# Altium schematic sheet Elkapod_power_supply_conveter_module.SchDoc: Elkapod Power Supply Block Diagram
size A3; SheetNumber: 1; SheetTotal: 6
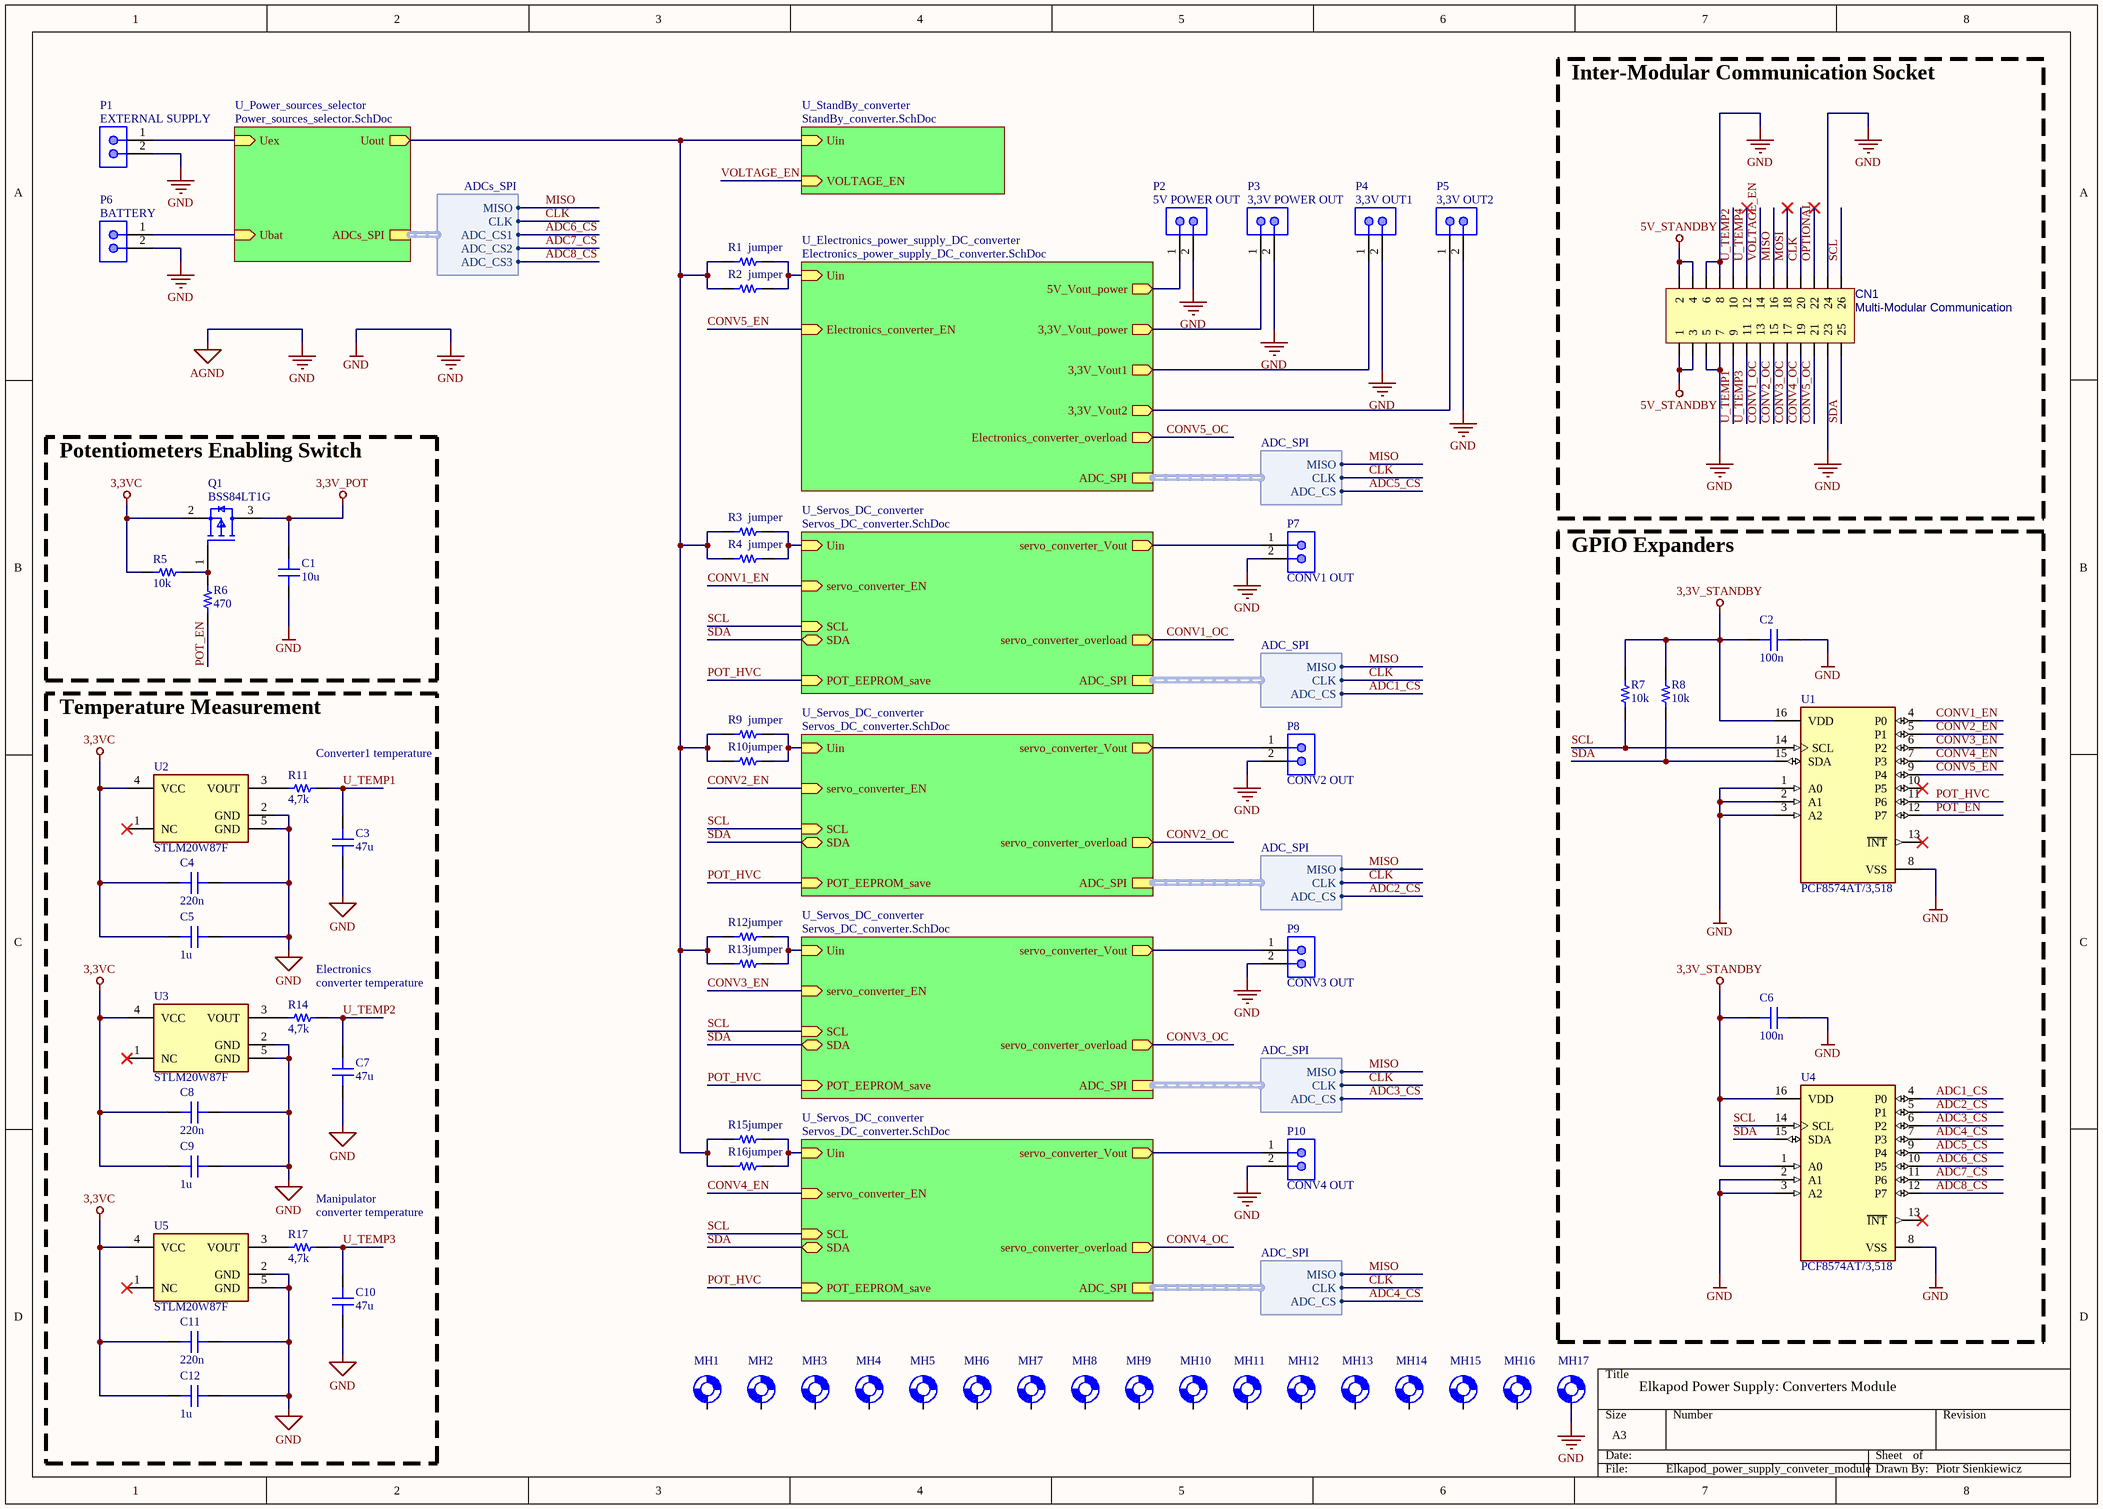
[diagram p0: Elkapod_power_supply_conveter_module.SchDoc]

## Parts
C1  10u  [CAP 0603_1608]
C2  100n  [CAP 0603_1608]
C3  47u  [CAP 0603_1608]
C4  220n  [CAP 0603_1608]
C5  1u  [CAP 0603_1608]
C6  100n  [CAP 0603_1608]
C7  47u  [CAP 0603_1608]
C8  220n  [CAP 0603_1608]
C9  1u  [CAP 0603_1608]
C10  47u  [CAP 0603_1608]
C11  220n  [CAP 0603_1608]
C12  1u  [CAP 0603_1608]
CN1  Multi-Modular Communication  [GP_13x2_F]
MH1  M3 Mounting Hole  [M3_MOUNTING_HOLE]  (value not drawn)
MH2  M3 Mounting Hole  [M3_MOUNTING_HOLE]  (value not drawn)
MH3  M3 Mounting Hole  [M3_MOUNTING_HOLE]  (value not drawn)
MH4  M3 Mounting Hole  [M3_MOUNTING_HOLE]  (value not drawn)
MH5  M3 Mounting Hole  [M3_MOUNTING_HOLE]  (value not drawn)
MH6  M3 Mounting Hole  [M3_MOUNTING_HOLE]  (value not drawn)
MH7  M3 Mounting Hole  [M3_MOUNTING_HOLE]  (value not drawn)
MH8  M3 Mounting Hole  [M3_MOUNTING_HOLE]  (value not drawn)
MH9  M3 Mounting Hole  [M3_MOUNTING_HOLE]  (value not drawn)
MH10  M3 Mounting Hole  [M3_MOUNTING_HOLE]  (value not drawn)
MH11  M3 Mounting Hole  [M3_MOUNTING_HOLE]  (value not drawn)
MH12  M3 Mounting Hole  [M3_MOUNTING_HOLE]  (value not drawn)
MH13  M3 Mounting Hole  [M3_MOUNTING_HOLE]  (value not drawn)
MH14  M3 Mounting Hole  [M3_MOUNTING_HOLE]  (value not drawn)
MH15  M3 Mounting Hole  [M3_MOUNTING_HOLE]  (value not drawn)
MH16  M3 Mounting Hole  [M3_MOUNTING_HOLE]  (value not drawn)
MH17  M3 Mounting Hole  [M3_MOUNTING_HOLE]  (value not drawn)
P1  EXTERNAL SUPPLY  [XT60PB-M]
P2  5V POWER OUT  [2x2,5mm2_WIRE]
P3  3,3V POWER OUT  [2x2,5mm2_WIRE]
P4  3,3V OUT1  [2x2,5mm2_WIRE]
P5  3,3V OUT2  [2x2,5mm2_WIRE]
P6  BATTERY  [XT60PB-M]
P7  CONV1 OUT  [2x2,5mm2_WIRE]
P8  CONV2 OUT  [2x2,5mm2_WIRE]
P9  CONV3 OUT  [2x2,5mm2_WIRE]
P10  CONV4 OUT  [2x2,5mm2_WIRE]
Q1  BSS84LT1G  [FP-318-08-IPC_A]
R1  jumper  [STACKPOLE CSM2512]
R2  jumper  [STACKPOLE CSM2512]
R3  jumper  [STACKPOLE CSM2512]
R4  jumper  [STACKPOLE CSM2512]
R5  10k  [RES 0603_1608]
R6  470  [RES 0603_1608]
R7  10k  [RES 0603_1608]
R8  10k  [RES 0603_1608]
R9  jumper  [STACKPOLE CSM2512]
R10  jumper  [STACKPOLE CSM2512]
R11  4,7k  [RES 0603_1608]
R12  jumper  [STACKPOLE CSM2512]
R13  jumper  [STACKPOLE CSM2512]
R14  4,7k  [RES 0603_1608]
R15  jumper  [STACKPOLE CSM2512]
R16  jumper  [STACKPOLE CSM2512]
R17  4,7k  [RES 0603_1608]
U1  PCF8574AT/3,518  [FP-SOT162-1-MFG]
U2  STLM20W87F  [FP-SOT323-5L-7091413-MFG]
U3  STLM20W87F  [FP-SOT323-5L-7091413-MFG]
U4  PCF8574AT/3,518  [FP-SOT162-1-MFG]
U5  STLM20W87F  [FP-SOT323-5L-7091413-MFG]

## Blocks framed on the sheet
Inter-Modular Communication Socket: CN1
Potentiometers Enabling Switch: C1 Q1 R5 R6
GPIO Expanders: C2 C6 R7 R8 U1 U4
Temperature Measurement: C3-C5 C7-C12 R11 R14 R17 U2 U3 U5

## Sub-sheets
U_Electronics_power_supply_DC_converter = Electronics_power_supply_DC_converter.SchDoc: Uin (in), Electronics_converter_EN (in), Electronics_converter_overload (out), 3,3V_Vout2 (out), 3,3V_Vout1 (out), 3,3V_Vout_power (out), 5V_Vout_power (out), ADC_SPI (harness ADC_SPI)
U_Power_sources_selector = Power_sources_selector.SchDoc: Ubat (in), Uout (out), Uex (in), ADCs_SPI (harness ADCs_SPI)
U_Servos_DC_converter = Servos_DC_converter.SchDoc: Uin (in), servo_converter_EN (in), servo_converter_overload (out), servo_converter_Vout (out), POT_EEPROM_save (in), SDA (bidir), SCL (in), ADC_SPI (harness ADC_SPI)  | RF2_value: 2,7k; RF1_value: 1k; RF3_value: 910
U_Servos_DC_converter = Servos_DC_converter.SchDoc: Uin (in), servo_converter_EN (in), servo_converter_overload (out), servo_converter_Vout (out), POT_EEPROM_save (in), SDA (bidir), SCL (in), ADC_SPI (harness ADC_SPI)  | RF2_value: 2,7k; RF1_value: 1k; RF3_value: 910
U_Servos_DC_converter = Servos_DC_converter.SchDoc: Uin (in), servo_converter_EN (in), servo_converter_overload (out), servo_converter_Vout (out), POT_EEPROM_save (in), SDA (bidir), SCL (in), ADC_SPI (harness ADC_SPI)  | RF2_value: 2,7k; RF1_value: 1k; RF3_value: 910
U_Servos_DC_converter = Servos_DC_converter.SchDoc: Uin (in), servo_converter_EN (in), servo_converter_overload (out), servo_converter_Vout (out), POT_EEPROM_save (in), SDA (bidir), SCL (in), ADC_SPI (harness ADC_SPI)  | RF2_value: 6,8k; RF1_value: 3,3k; RF3_value: 1,3k
U_StandBy_converter = StandBy_converter.SchDoc: Uin (in), VOLTAGE_EN (in)

## Harnesses
ADC_SPI: MISO, CLK, ADC_CS
ADCs_SPI: MISO, CLK, ADC_CS1, ADC_CS2, ADC_CS3

## Nets
3,3V_POT: C1.2 Q1.3(D)
3,3V_STANDBY: C2.2 C6.2 R7.2 R8.2 U1.16(VDD) U4.1(A0) U4.16(VDD)
3,3VC: C4.2 C5.2 C8.2 C9.2 C11.2 C12.2 Q1.2(S) R5.1 U2.4(VCC) U3.4(VCC) U5.4(VCC)
5V_STANDBY: CN1.1 CN1.2 CN1.3 CN1.4
AGND: C1.1 C2.1 C3.1 C4.1 C5.1 C6.1 C7.1 C8.1 C9.1 C10.1 C11.1 C12.1 CN1.5 CN1.6 CN1.7 CN1.8 CN1.23 CN1.24 MH17.1 P1.2(-) P2.2(-) P3.2(-) P4.2(-) P5.2(-) P6.2(-) P7.2(-) P8.2(-) P9.2(-) P10.2(-) U1.1(A0) U1.2(A1) U1.3(A2) U1.8(VSS) U2.2(GND) U2.5(GND) U3.2(GND) U3.5(GND) U4.2(A1) U4.3(A2) U4.8(VSS) U5.2(GND) U5.5(GND)  [also labelled GND]
ADC1_CS: U4.4(P0) ; sheet U_Servos_DC_converter/ADC_SPI.ADC_CS
ADC2_CS: U4.5(P1) ; sheet U_Servos_DC_converter/ADC_SPI.ADC_CS
ADC3_CS: U4.6(P2) ; sheet U_Servos_DC_converter/ADC_SPI.ADC_CS
ADC4_CS: U4.7(P3) ; sheet U_Servos_DC_converter/ADC_SPI.ADC_CS
ADC5_CS: U4.9(P4) ; sheet U_Electronics_power_supply_DC_converter/ADC_SPI.ADC_CS
ADC6_CS: U4.10(P5) ; sheet U_Power_sources_selector/ADCs_SPI.ADC_CS1
ADC7_CS: U4.11(P6) ; sheet U_Power_sources_selector/ADCs_SPI.ADC_CS2
ADC8_CS: U4.12(P7) ; sheet U_Power_sources_selector/ADCs_SPI.ADC_CS3
CLK: CN1.20 ; sheet U_Electronics_power_supply_DC_converter/ADC_SPI.CLK, sheet U_Servos_DC_converter/ADC_SPI.CLK, sheet U_Power_sources_selector/ADCs_SPI.CLK
CONV1_EN: U1.4(P0) ; sheet U_Servos_DC_converter/servo_converter_EN
CONV1_OC: CN1.13 ; sheet U_Servos_DC_converter/servo_converter_overload
CONV2_EN: U1.5(P1) ; sheet U_Servos_DC_converter/servo_converter_EN
CONV2_OC: CN1.15 ; sheet U_Servos_DC_converter/servo_converter_overload
CONV3_EN: U1.6(P2) ; sheet U_Servos_DC_converter/servo_converter_EN
CONV3_OC: CN1.17 ; sheet U_Servos_DC_converter/servo_converter_overload
CONV4_EN: U1.7(P3) ; sheet U_Servos_DC_converter/servo_converter_EN
CONV4_OC: CN1.19 ; sheet U_Servos_DC_converter/servo_converter_overload
CONV5_EN: U1.9(P4) ; sheet U_Electronics_power_supply_DC_converter/Electronics_converter_EN
CONV5_OC: CN1.21 ; sheet U_Electronics_power_supply_DC_converter/Electronics_converter_overload
MISO: CN1.16 ; sheet U_Electronics_power_supply_DC_converter/ADC_SPI.MISO, sheet U_Servos_DC_converter/ADC_SPI.MISO, sheet U_Power_sources_selector/ADCs_SPI.MISO
MOSI: CN1.18
OPTIONAL: CN1.22
POT_EN: R6.2 U1.12(P7)
POT_HVC: U1.11(P6) ; sheet U_Servos_DC_converter/POT_EEPROM_save, sheet U_Servos_DC_converter/POT_EEPROM_save, sheet U_Servos_DC_converter/POT_EEPROM_save, sheet U_Servos_DC_converter/POT_EEPROM_save
SCL: CN1.26 R7.1 U1.14(SCL) U4.14(SCL) ; sheet U_Servos_DC_converter/SCL, sheet U_Servos_DC_converter/SCL, sheet U_Servos_DC_converter/SCL, sheet U_Servos_DC_converter/SCL
SDA: CN1.25 R8.1 U1.15(SDA) U4.15(SDA) ; sheet U_Servos_DC_converter/SDA, sheet U_Servos_DC_converter/SDA, sheet U_Servos_DC_converter/SDA, sheet U_Servos_DC_converter/SDA
U_TEMP1: C3.2 CN1.9 R11.2
U_TEMP2: C7.2 CN1.10 R14.2
U_TEMP3: C10.2 CN1.11 R17.2
U_TEMP4: CN1.12
VOLTAGE_EN: CN1.14 ; sheet U_StandBy_converter/VOLTAGE_EN
NetP1_1: P1.1(+) ; sheet U_Power_sources_selector/Uex
NetP2_1: P2.1(+) ; sheet U_Electronics_power_supply_DC_converter/5V_Vout_power
NetP3_1: P3.1(+) ; sheet U_Electronics_power_supply_DC_converter/3,3V_Vout_power
NetP4_1: P4.1(+) ; sheet U_Electronics_power_supply_DC_converter/3,3V_Vout1
NetP5_1: P5.1(+) ; sheet U_Electronics_power_supply_DC_converter/3,3V_Vout2
NetP6_1: P6.1(+) ; sheet U_Power_sources_selector/Ubat
NetP7_1: P7.1(+) ; sheet U_Servos_DC_converter/servo_converter_Vout
NetP8_1: P8.1(+) ; sheet U_Servos_DC_converter/servo_converter_Vout
NetP9_1: P9.1(+) ; sheet U_Servos_DC_converter/servo_converter_Vout
NetP10_1: P10.1(+) ; sheet U_Servos_DC_converter/servo_converter_Vout
NetQ1_1: Q1.1(G) R5.2 R6.1
NetR1_1: R1.1 R2.1 ; sheet U_Electronics_power_supply_DC_converter/Uin
NetR1_2: R1.2 R2.2 R3.2 R4.2 R9.2 R10.2 R12.2 R13.2 R15.2 R16.2 ; sheet U_Power_sources_selector/Uout, sheet U_StandBy_converter/Uin
NetR3_1: R3.1 R4.1 ; sheet U_Servos_DC_converter/Uin
NetR9_1: R9.1 R10.1 ; sheet U_Servos_DC_converter/Uin
NetR11_1: R11.1 U2.3(VOUT)
NetR12_1: R12.1 R13.1 ; sheet U_Servos_DC_converter/Uin
NetR14_1: R14.1 U3.3(VOUT)
NetR15_1: R15.1 R16.1 ; sheet U_Servos_DC_converter/Uin
NetR17_1: R17.1 U5.3(VOUT)

Not connected (* = marked no-connect by the designer): MH1 1; MH2 1; MH3 1; MH4 1; MH5 1; MH6 1; MH7 1; MH8 1; MH9 1; MH10 1; MH11 1; MH12 1; MH13 1; MH14 1; MH15 1; MH16 1; U1 10(P5)* 13(~{INT})*; U2 1(NC)*; U3 1(NC)*; U4 13(~{INT})*; U5 1(NC)*

## Notes on the sheet
- (near R11) Converter1 temperature
- (near R14) converter temperature
- (near R14) Electronics
- (near R17) converter temperature
- (near R17) Manipulator
- Elkapod Power Supply: Converters Module
- Piotr Sienkiewicz

## Library data of the parts
C1 = C0603C272F3GAC7867: CAP CER 10uF 35V X5R 0603; manufacturer: KEMET; Temperature Coefficient: C0G, NP0; Tolerance: ±1%; Voltage - Rated: 25V; Part Number: C0603C272F3GAC7867; Value: 10u; Applications: General Purpose; Capacitance: 10u; componentlink1description: Datasheet; componentlink1url: https://api.kemet.com/component-edge/download/datasheet/C0603C272F3GACTU.pdf; componentlink2description: DigiKey Link; componentlink2url: https://www.digikey.com/en/products/detail/kemet/C0603C272F3GAC7867/2200413; Device Package: 0603 (1608 Metric); Features: Low ESL; lastupdated: 09.02.2024 20:10:30; Lifecycle Status: Active; Minimum Order: 1; Mounting Type: Surface Mount, MLCC; Operating Temperature: -55°C ~ 125°C; Package / Case: 0603 (1608 Metric); packaging: TapeAndReel; partid: 2138; Part Status: Active; price: 0.40; series: SMD Comm C0G; Size / Dimension: 0.063" L x 0.031" W (1.60mm x 0.80mm); Thickness (Max): 0.034" (0.87mm)
C2 C6 = C0603C272F3GAC7867: CAP CER 100nF 25V X5R 0603; manufacturer: KEMET; Temperature Coefficient: C0G, NP0; Tolerance: ±1%; Part Number: C0603C272F3GAC7867; Value: 100n; Applications: General Purpose; Capacitance: 100n; componentlink1description: Datasheet; componentlink1url: https://api.kemet.com/component-edge/download/datasheet/C0603C272F3GACTU.pdf; componentlink2description: DigiKey Link; componentlink2url: https://www.digikey.com/en/products/detail/kemet/C0603C272F3GAC7867/2200413; Device Package: 0603 (1608 Metric); Features: Low ESL; lastupdated: 09.02.2024 20:10:30; Lifecycle Status: Active; Minimum Order: 1; Mounting Type: Surface Mount, MLCC; Operating Temperature: -55°C ~ 125°C; Package / Case: 0603 (1608 Metric); packaging: TapeAndReel; partid: 2138; Part Status: Active; price: 0.40; series: SMD Comm C0G; Size / Dimension: 0.063" L x 0.031" W (1.60mm x 0.80mm); Thickness (Max): 0.034" (0.87mm); Voltage - Rated: 25V
C3 C7 C10 = C0603C272F3GAC7867: CAP CER 47uF 6,3V X5R 0603; manufacturer: KEMET; Temperature Coefficient: C0G, NP0; Tolerance: ±1%; Voltage - Rated: 25V; Part Number: C0603C272F3GAC7867; Value: 47u; Applications: General Purpose; Capacitance: 47u; componentlink1description: Datasheet; componentlink1url: https://api.kemet.com/component-edge/download/datasheet/C0603C272F3GACTU.pdf; componentlink2description: DigiKey Link; componentlink2url: https://www.digikey.com/en/products/detail/kemet/C0603C272F3GAC7867/2200413; Device Package: 0603 (1608 Metric); Features: Low ESL; lastupdated: 09.02.2024 20:10:30; Lifecycle Status: Active; Minimum Order: 1; Mounting Type: Surface Mount, MLCC; Operating Temperature: -55°C ~ 125°C; Package / Case: 0603 (1608 Metric); packaging: TapeAndReel; partid: 2138; Part Status: Active; price: 0.40; series: SMD Comm C0G; Size / Dimension: 0.063" L x 0.031" W (1.60mm x 0.80mm); Thickness (Max): 0.034" (0.87mm)
C4 C8 C11 = C0603C272F3GAC7867: CAP CER 220nF 25V X5R 0603; manufacturer: KEMET; Temperature Coefficient: C0G, NP0; Tolerance: ±1%; Part Number: C0603C272F3GAC7867; Value: 220n; Applications: General Purpose; Capacitance: 220n; componentlink1description: Datasheet; componentlink1url: https://api.kemet.com/component-edge/download/datasheet/C0603C272F3GACTU.pdf; componentlink2description: DigiKey Link; componentlink2url: https://www.digikey.com/en/products/detail/kemet/C0603C272F3GAC7867/2200413; Device Package: 0603 (1608 Metric); Features: Low ESL; lastupdated: 09.02.2024 20:10:30; Lifecycle Status: Active; Minimum Order: 1; Mounting Type: Surface Mount, MLCC; Operating Temperature: -55°C ~ 125°C; Package / Case: 0603 (1608 Metric); packaging: TapeAndReel; partid: 2138; Part Status: Active; price: 0.40; series: SMD Comm C0G; Size / Dimension: 0.063" L x 0.031" W (1.60mm x 0.80mm); Thickness (Max): 0.034" (0.87mm); Voltage - Rated: 25V
C5 C9 C12 = C0603C272F3GAC7867: CAP CER 1uF 25V X5R 0603; manufacturer: KEMET; Temperature Coefficient: C0G, NP0; Tolerance: ±1%; Part Number: C0603C272F3GAC7867; Value: 1u; Applications: General Purpose; Capacitance: 1u; componentlink1description: Datasheet; componentlink1url: https://api.kemet.com/component-edge/download/datasheet/C0603C272F3GACTU.pdf; componentlink2description: DigiKey Link; componentlink2url: https://www.digikey.com/en/products/detail/kemet/C0603C272F3GAC7867/2200413; Device Package: 0603 (1608 Metric); Features: Low ESL; lastupdated: 09.02.2024 20:10:30; Lifecycle Status: Active; Minimum Order: 1; Mounting Type: Surface Mount, MLCC; Operating Temperature: -55°C ~ 125°C; Package / Case: 0603 (1608 Metric); packaging: TapeAndReel; partid: 2138; Part Status: Active; price: 0.40; series: SMD Comm C0G; Size / Dimension: 0.063" L x 0.031" W (1.60mm x 0.80mm); Thickness (Max): 0.034" (0.87mm); Voltage - Rated: 25V
CN1 = CN_13x2
P1 P6 = XT60PB-M: XT60UPB-M; 30A/500V straight female DC PCB socket (pin1 -> +, pin2 -> -)
P2-P5 P7-P10 = 2X2,5mm2_WIRE: 2x2,5mm2 wire pads
Q1 = CMP-1058-00762-2: MOSFET P-CH 50V 130MA SOT-23; Max Power Dissipation: 225mW; On-State Resistance: 10R; Nominal Vgs: 2V; Gate to Source Voltage (Vgs): 20V; Rise Time: 1ns; Turn-Off Delay Time: 16ns; Voltage Rating (DC): -50V; Turn-On Delay Time: 3.6ns; Number of Elements: 1; Current Rating: -130mA; Input Capacitance: 30pF; Threshold Voltage: -2V; Element Configuration: Single; Drain to Source Breakdown Voltage: 50V; Continuous Drain Current (ID): 130mA; Length: 0.119inch; Drain to Source Voltage (Vdss): 50V; Min Operating Temperature: -55°C; Contact Plating: Tin; Lead Free: Lead Free; Width: 0.055inch; Case/Package: SOT-23-3; Max Operating Temperature: 150°C; Halogen Free: Halogen Free; Radiation Hardening: No; Drain to Source Resistance: 10R; REACH SVHC: No SVHC; Power Dissipation: 225mW; Number of Pins: 3; Package Quantity: 1; Packaging: Tape and Reel; Fall Time: 1ns; Rds On Max: 10R; Height: 0.04inch
R1-R4 R9 R10 R12 R13 R15 R16 = CSM2512FT20L0: RES 0 OHM 1W 2512; manufacturer: Stackpole Electronics Inc; Power (Watts): 3W; Temperature Coefficient: ±50ppm/°C; Tolerance: ±1%; value: 20 mOhms; Part Number: CSM2512FT20L0; componentlink1description: Datasheet; componentlink1url: https://www.seielect.com/Catalog/SEI-CSM.PDF; componentlink2description: DigiKey Link; componentlink2url: https://www.digikey.com/en/products/detail/stackpole-electronics-inc/CSM2512FT20L0/6270239; Composition: Metal Element; Device Package: 2512 (6332 Metric); Features: Current Sense; Height - Seated (Max): 0.035" (0.90mm); lastupdated: 03.06.2024 20:27:03; Lifecycle Status: Active; Minimum Order: 4000; Number of Terminations: 2; Operating Temperature: -55°C ~ 170°C; Package / Case: 2512 (6332 Metric); packaging: TapeAndReel; Part Status: Active; price: 0.19; Resistance: jumper; series: CSM; Size / Dimension: 0.252" L x 0.126" W (6.40mm x 3.20mm); Supplier Device Package: 2512
R5 R7 R8 = RNCS0603BKE10K0: RES 10K OHM 1% 0,1W 0603; Manufacturer: Stackpole Electronics Inc; Power (Watts): 0.063W, 1/16W; Temperature Coefficient: ±25ppm/°C; Tolerance: ±0.1%; Part Number: RNCS0603BKE10K0; Value: 10k; Composition: Thin Film; Device Package: 0603 (1608 Metric); Features: Anti-Corrosive, Automotive AEC-Q200, Moisture Resistant; Height - Seated (Max): 0.022" (0.55mm); LastUpdated: 09.02.2024 20:43:37; Lifecycle Status: Active; Minimum Order: 1; Number of Terminations: 2; Operating Temperature: -55°C ~ 155°C; Package / Case: 0603 (1608 Metric); Packaging: TapeAndReel; PartId: 4838; Part Status: Active; Price: 0.06; Ratings: AEC-Q200; Resistance: 10k; Series: RNCS; Size / Dimension: 0.061" L x 0.031" W (1.55mm x 0.80mm); Supplier Device Package: 0603
R6 = RNCS0603BKE10K0: RES 470 OHM 1% 0,1W 0603; Manufacturer: Stackpole Electronics Inc; Power (Watts): 0.063W, 1/16W; Temperature Coefficient: ±25ppm/°C; Tolerance: ±0.1%; Part Number: RNCS0603BKE10K0; Value: 470; Composition: Thin Film; Device Package: 0603 (1608 Metric); Features: Anti-Corrosive, Automotive AEC-Q200, Moisture Resistant; Height - Seated (Max): 0.022" (0.55mm); LastUpdated: 09.02.2024 20:43:37; Lifecycle Status: Active; Minimum Order: 1; Number of Terminations: 2; Operating Temperature: -55°C ~ 155°C; Package / Case: 0603 (1608 Metric); Packaging: TapeAndReel; PartId: 4838; Part Status: Active; Price: 0.06; Ratings: AEC-Q200; Resistance: 470; Series: RNCS; Size / Dimension: 0.061" L x 0.031" W (1.55mm x 0.80mm); Supplier Device Package: 0603
R11 R14 R17 = RNCS0603BKE10K0: RES 4,7K OHM 1% 0,1W 0603; Manufacturer: Stackpole Electronics Inc; Power (Watts): 0.063W, 1/16W; Temperature Coefficient: ±25ppm/°C; Tolerance: ±0.1%; Part Number: RNCS0603BKE10K0; Value: 4,7k; Composition: Thin Film; Device Package: 0603 (1608 Metric); Features: Anti-Corrosive, Automotive AEC-Q200, Moisture Resistant; Height - Seated (Max): 0.022" (0.55mm); LastUpdated: 09.02.2024 20:43:37; Lifecycle Status: Active; Minimum Order: 1; Number of Terminations: 2; Operating Temperature: -55°C ~ 155°C; Package / Case: 0603 (1608 Metric); Packaging: TapeAndReel; PartId: 4838; Part Status: Active; Price: 0.06; Ratings: AEC-Q200; Resistance: 4,7k; Series: RNCS; Size / Dimension: 0.061" L x 0.031" W (1.55mm x 0.80mm); Supplier Device Package: 0603
U1 U4 = CMP-10112-000003-1: IC I/O EXPANDER I2C 8B 16SOIC; Manufacturer: NXP Semiconductors; Interface: I2C,SMBus; Frequency: 100kHz; Nominal Supply Current: 40uA; Max Supply Voltage: 6V; Number Of I/Os: 8; Max Junction Temp: +125°C; Min Supply Voltage: 2.5V; Standoff Height: 0.1mm; RoHS: TRUE; Category: IC; Temperature: -40°C to +85°C; Device Class L3: I/O Expanders; ComponentLink2Description: Datasheet; ComponentLink2URL: https://www.nxp.com/docs/en/data-sheet/PCF8574_PCF8574A.pdf; Digikey Description: IC I/O EXPANDER I2C 8B 16SOIC; Ipc Land Pattern Name: SOIC127P1032X265-16; Mouser Description: PCF8574 Series 2.5 to 6V Remote 8-bit I/O Expander for I2C-bus -SOIC-16; Footprint Url: https://www.nxp.com/docs/en/package-information/SOT162-1.pdf; Lead Free: Yes; Device Class L2: Interface ICs; Ambient Temperature Range Low: -40°C; Temperature Range High: +85°C; Automotive: No; Manufacturer Part Number: PCF8574AT/3,518; Ambient Temperature Range High: +85°C; Height: 2.65mm; Package: SOT162-1; Temperature Range Low: -40°C; Octopart: https://octopart.com/pcf8574at%2F3%2C518-nxp+semiconductors-11541925; Device Class L1: Integrated Circuits (ICs)
U2 U3 U5 = CMP-12184-000003-1: SENSOR ANALOG -55C-130C SOT323-5; Manufacturer: STMicroelectronics; Max Junction Temp: +150°C; Standoff Height: 0mm; Operating Supply Current: 4.8uA; Max Supply Voltage: 5.5V; Output Current: 10mA; Sensor Output: Analog Voltage; Min Supply Voltage: 2.4V; Output Voltage: 1.8639V; Temperature Range High: +130°C; Digikey Description: SENSOR ANALOG -55C-130C SOT323-5; Temperature: -55°C to +130°C; Mouser Description: Temperature Sensor Ic, Voltage, 1.5 C, -55 C, +130 C, Sc-70, 5 Rohs Compliant: Yes; Device Class L3: unset; Category: IC; Device Class L1: Sensors; Lead Free: Yes; ComponentLink2URL: https://www.st.com/resource/en/datasheet/stlq020.pdf; Package: SOT323-5L-7091413; Temperature Range Low: -55°C; Ambient Temperature Range Low: -55°C; Automotive: No; Manufacturer Part Number: STLM20W87F; Ambient Temperature Range High: +130°C; RoHS: TRUE; Octopart: https://octopart.com/stlm20w87f-stmicroelectronics-4006294; Height: 1.1mm; ComponentLink2Description: Datasheet; Ipc Land Pattern Name: SOT65P210X95-5; Device Class L2: Temperature and Humidity Sensors